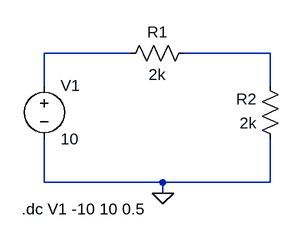
[diagram p0: schematic 1_Zadatak_Lab1.asc]
1_Zadatak_Lab1.asc, the LTspice schematic file:
Version 4
SHEET 1 880 680
WIRE 160 112 32 112
WIRE 368 112 240 112
WIRE 32 160 32 112
WIRE 368 160 368 112
WIRE 32 304 32 240
WIRE 208 304 32 304
WIRE 368 304 368 240
WIRE 368 304 208 304
WIRE 208 320 208 304
FLAG 208 320 0
SYMBOL res 256 96 R90
WINDOW 0 0 56 VBottom 2
WINDOW 3 32 56 VTop 2
SYMATTR InstName R1
SYMATTR Value 2k
SYMBOL res 384 256 R180
WINDOW 0 36 76 Left 2
WINDOW 3 36 40 Left 2
SYMATTR InstName R2
SYMATTR Value 2k
SYMBOL voltage 32 144 R0
SYMATTR InstName V1
SYMATTR Value 10
TEXT -2 344 Left 2 !.dc V1 -10 10 0.5

The netlist it stands for:
* 1_Zadatak_Lab1.asc
R1 N002 N001 2k
R2 0 N002 2k
V1 N001 0 10
.dc V1 -10 10 0.5
.backanno
.end